# Altium schematic sheet adda副1.SchDoc
size A4
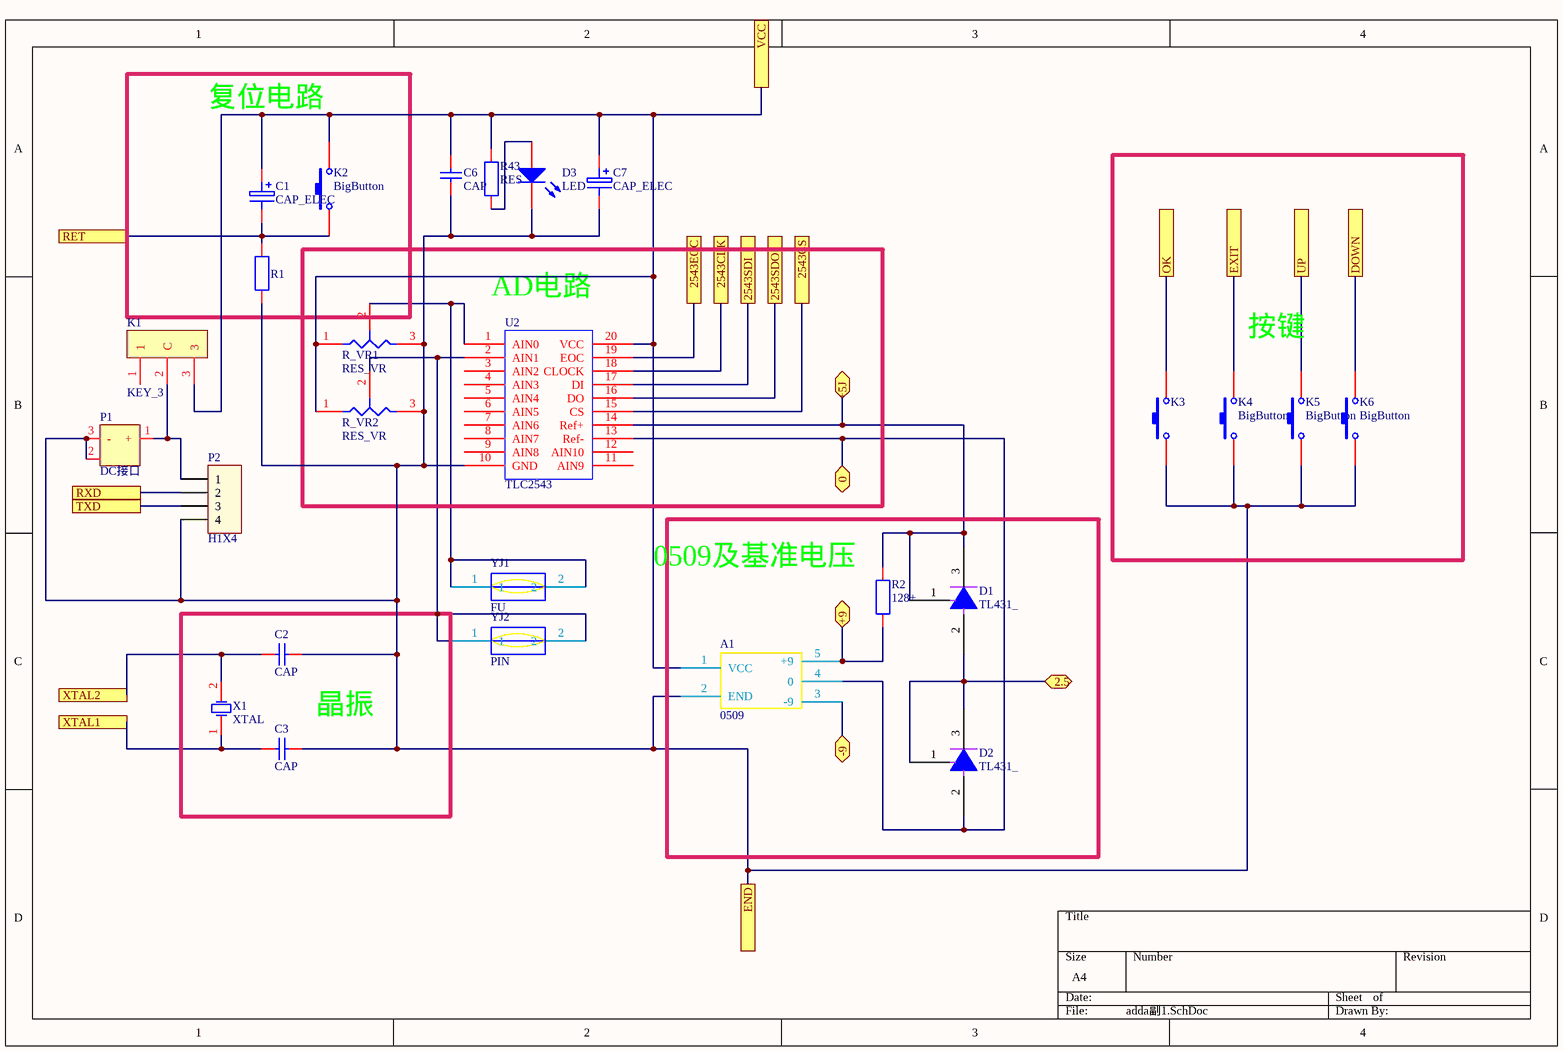
[diagram p0: adda副1.SchDoc]

## Parts
A1  0509  [0509]
C1  CAP_ELEC  [CAP[25V]]
C2  CAP  [Cap-Dip]
C3  CAP  [Cap-Dip]
C6  CAP  [Cap-Dip]
C7  CAP_ELEC  [CAP[16V]]
D1  TL431_  [TO_92]
D2  TL431_  [TO_92]
D3  LED  [LED]
K1  KEY_3  [KEY_3]
K2  BigButton  [BigButton]
K3  BigButton  [BigButton]  (value not drawn)
K4  BigButton  [BigButton]
K5  BigButton  [BigButton]
K6  BigButton  [BigButton]
P1  DC接口  [DC接口]
P2  H1X4  [H2.54_1X4]
R1  RES  [RES_DIP]  (value not drawn)
R2  128+  [RES_DIP]
R43  RES  [RES_DIP]
R_VR1  RES_VR  [GUI_DA]
R_VR2  RES_VR  [GUI_DA]
U2  TLC2543  [DIP_20]
X1  XTAL  [XTAL_DIP]
YJ1  FU  [DIP2]
YJ2  PIN  [DIP2]

## Blocks framed on the sheet
复位电路: C1 K2 R1
按键: K3-K6
AD电路: R_VR1 R_VR2 U2
晶振: C2 C3 X1

## Ports
0, 2.5, 2543CLK, 2543CS, 2543EOC, 2543SDI, 2543SDO, +5J, +9, -9, DOWN, END, EXIT, OK, RET, RXD, TXD, UP, VCC, XTAL1, XTAL2

## Nets
0: A1.4(0) D2.2 U2.13(Ref-) ; port 0
2.5: D1.2 D2.1 D2.3 ; port 2.5
2543CLK: U2.18(CLOCK) ; port 2543CLK
2543CS: U2.15(CS) ; port 2543CS
2543EOC: U2.19(EOC) ; port 2543EOC
2543SDI: U2.17(DI) ; port 2543SDI
2543SDO: U2.16(DO) ; port 2543SDO
+5J: D1.1 D1.3 R2.2 U2.14(Ref+) ; port +5J
+9: A1.5(+9) R2.1 ; port +9
-9: A1.3(-9) ; port -9
DOWN: K6.2 ; port DOWN
END: A1.2(END) C2.2 C3.2 C6.2 C7.2 D3.2(K) K3.1 K4.1 K5.1 K6.1 P1.2 P1.3(-) P2.4 R1.1 R_VR1.3 R_VR2.3 U2.10(GND) ; port END
EXIT: K4.2 ; port EXIT
OK: K3.2 ; port OK
RET: C1.2 K2.1 R1.2 ; port RET
RXD: P2.2 ; port RXD
TXD: P2.3 ; port TXD
UP: K5.2 ; port UP
VCC: A1.1(VCC) C1.1 C6.1 C7.1 K1.3 K2.2 R43.2 R_VR1.1 R_VR2.1 U2.20(VCC) ; port VCC
XTAL1: C3.1 X1.1(OSC1) ; port XTAL1
XTAL2: C2.1 X1.2(OSC2) ; port XTAL2
NetD3_1: D3.1(A) R43.1
NetK1_2: K1.2(C) P1.1(+) P2.1
NetR_VR1_2: R_VR1.2 U2.1(AIN0) YJ1.1 YJ1.2
NetR_VR2_2: R_VR2.2 U2.2(AIN1) YJ2.1 YJ2.2

Not connected (* = marked no-connect by the designer): K1 1; U2 3(AIN2) 4(AIN3) 5(AIN4) 6(AIN5) 7(AIN6) 8(AIN7) 9(AIN8) 11(AIN9) 12(AIN10)

## Notes on the sheet
- 0509及基准电压

## Library data of the parts
K1 = KEY_3: 乒乓开关
P1 = DC接口: 电源接口
R2 = RES
R_VR1 R_VR2 = RES_VR: 滑动变阻器
YJ1 YJ2 = DIP2